# EAGLE design BPM7004 RetroCade Synth MegaWing-alt3 (EAGLE 5.11)
DIGIKEY#: 311-390GRCT-ND
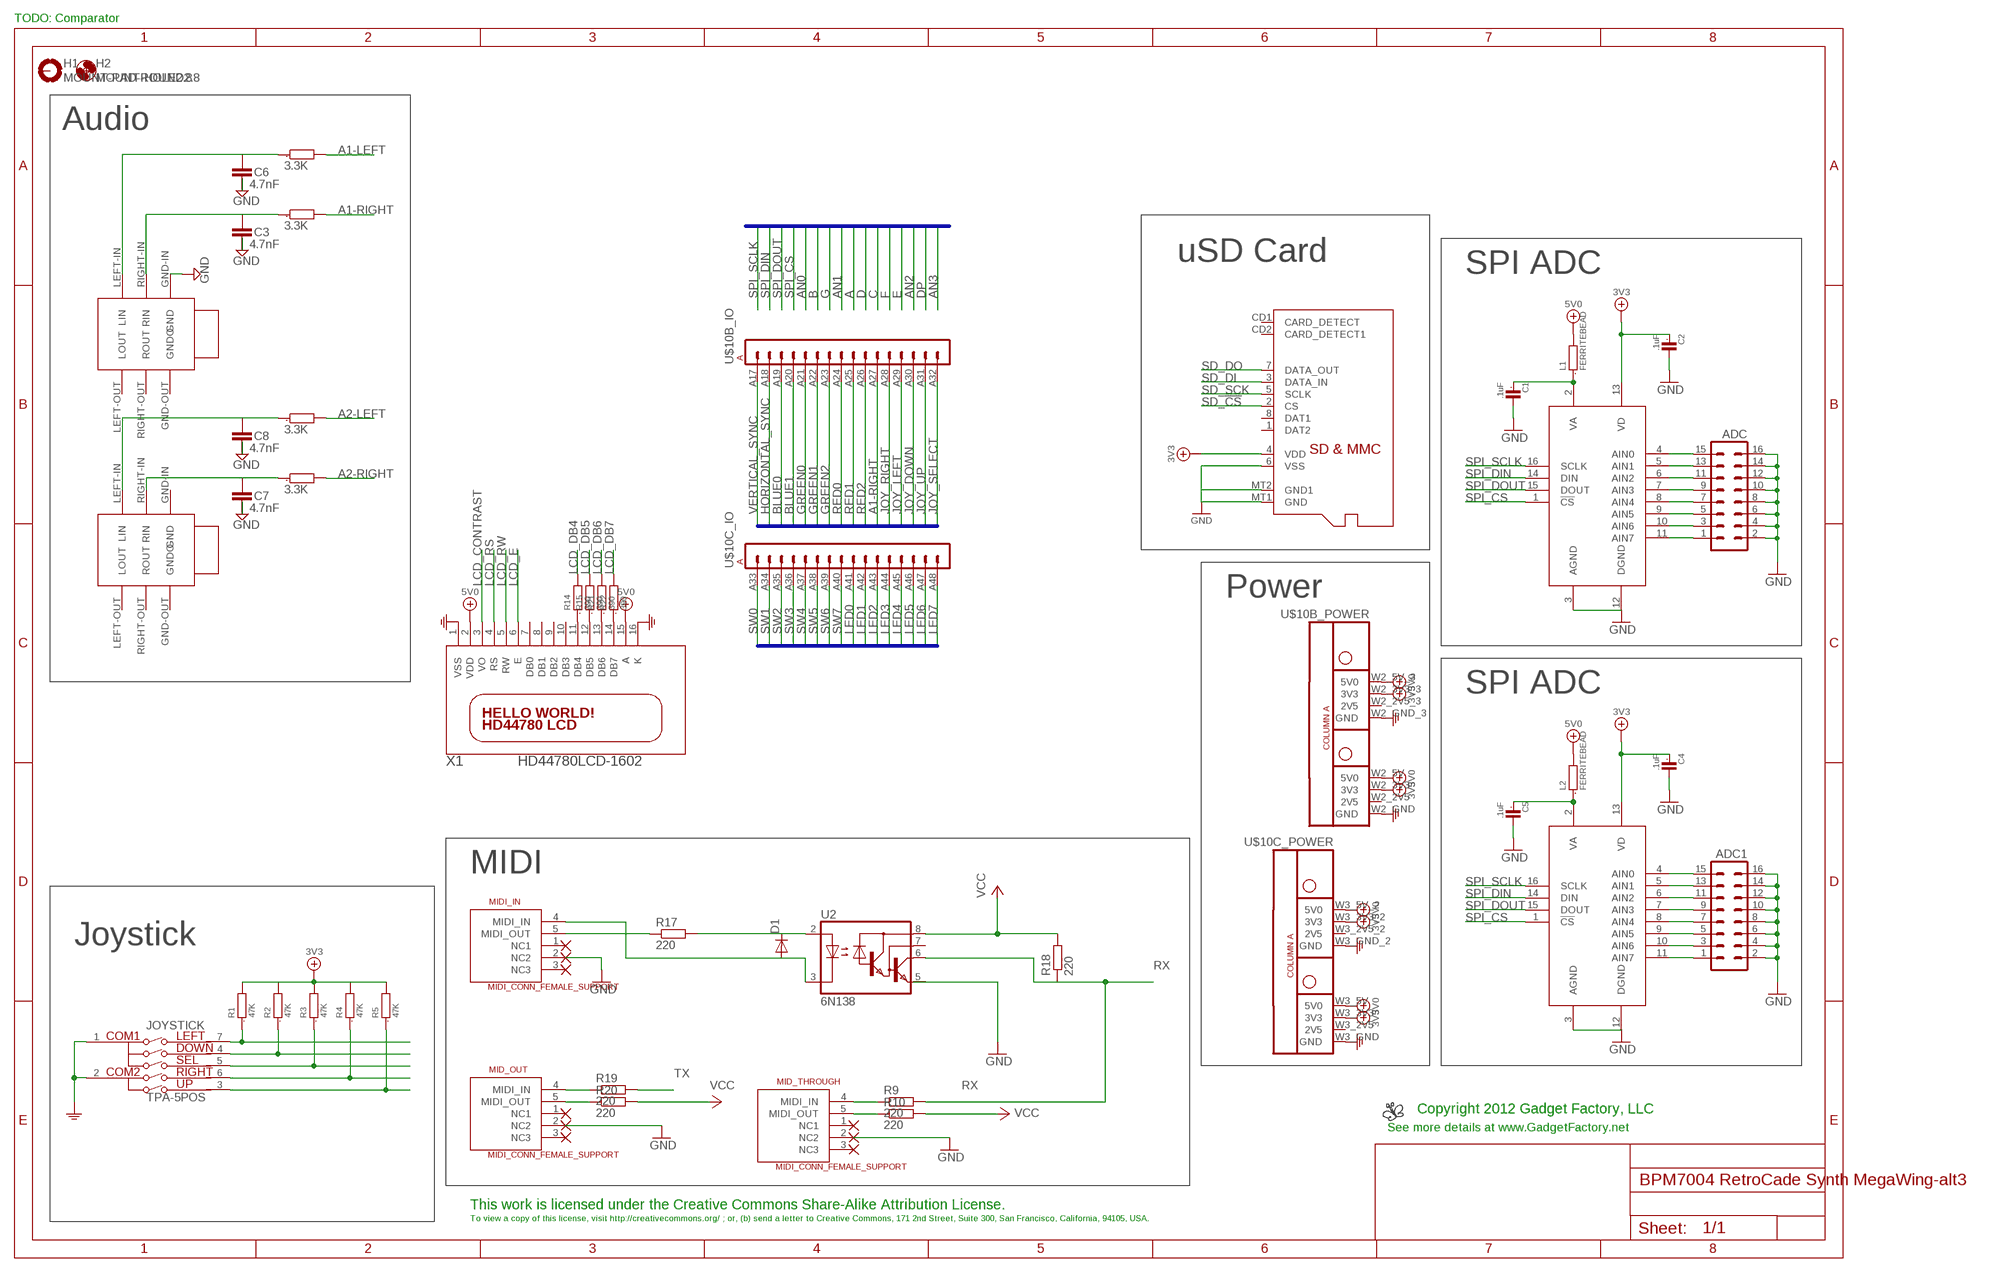
[diagram p0: schematic, sheet 1]

## Parts
A1  NMJ6HFD2  [NMJ6HFD2]
A2  NMJ6HFD2  [NMJ6HFD2]
ADC  MA08-2  [MA08-2]
ADC1  MA08-2  [MA08-2]
C1  .1uF  C0603  [0603]
C2  .1uF  C0603  [0603]
C3  4.7nF  C-EUC0603  [C0603]
C4  .1uF  C0603  [0603]
C5  .1uF  C0603  [0603]
C6  4.7nF  C-EUC0805  [C0805]
C7  4.7nF  C-EUC0603  [C0603]
C8  4.7nF  C-EUC0603  [C0603]
D1  DIODESOD  [SOD-323]
H1  MOUNT-PAD-ROUND2.8  [2,8-PAD]
H2  MOUNT-HOLE2.8  [2,8]
JOYSTICK  TPA-5POS  [TPA-5POS]
L1  FERRITEBEAD  R0603  [0603]
L2  FERRITEBEAD  R0603  [0603]
LOGO1  BUTTERFLY_LOGO  [BUTTERFLY_LOGO]
MID_OUT  MIDI_CONN_FEMALE_SUPPORT  [DIN_5_FEMALE_SUPPORT]
MID_THROUGH  MIDI_CONN_FEMALE_SUPPORT  [DIN_5_FEMALE_SUPPORT]
MIDI_IN  MIDI_CONN_FEMALE_SUPPORT  [DIN_5_FEMALE_SUPPORT]
R1  47K  R0603  [0603]
R2  47K  R0603  [0603]
R3  47K  R0603  [0603]
R4  47K  R0603  [0603]
R5  47K  R0603  [0603]
R6  3.3K  R0603  [0603]
R7  3.3K  R0603  [0603]
R8  3.3K  R0603  [0603]
R9  220  R-EU_R0805  [R0805]
R10  220  R-EU_R0805  [R0805]
R14  390  R0603  [0603]
R15  390  R0603  [0603]
R16  3.3K  R0603  [0603]
R17  220  R-EU_R0805  [R0805]
R18  220  R-EU_R0805  [R0805]
R19  220  R-EU_R0805  [R0805]
R20  220  R-EU_R0805  [R0805]
R21  390  R0603  [0603]
R22  390  R0603  [0603]
U1  ADC088S102CIMT  [TSSOP16]
U2  6N138  [DIL08]
U3  ADC088S102CIMT  [TSSOP16]
U$3  MICROSD  [MICROSD]
U$10  MEGAWING_HALF_P1  [MEGAWING_HALF_NOHOLES_P1]
X1  HD44780LCD-1602  [LCD1602]

## Nets
3V3: C2.1 C4.1 R1.2 R2.2 R3.2 R4.2 R5.2 U1.13(VD) U3.13(VD) U$3.4(VDD) U$10.W2_3V3(B_POWER:3V3) U$10.W2_3V3_3(B_POWER:3V3) U$10.W3_3V3(C_POWER:3V3) U$10.W3_3V3_2(C_POWER:3V3)
5V0: L1.2 L2.2 U$10.W2_5V(B_POWER:5V0) U$10.W2_5V_3(B_POWER:5V0) U$10.W3_5V(C_POWER:5V0) U$10.W3_5V_2(C_POWER:5V0) X1.2(VDD) X1.15(A)
A1-LEFT: R6.2
A1-RIGHT: R16.2 U$10.A27(B_IO:A11)
A2-LEFT: R8.2
A2-RIGHT: R7.2
BLUE0: U$10.A19(B_IO:A3)
BLUE1: U$10.A20(B_IO:A4)
GND: A1.GND-IN(GND) ADC1.2 ADC1.4 ADC1.6 ADC1.8 ADC1.10 ADC1.12 ADC1.14 ADC1.16 ADC.2 ADC.4 ADC.6 ADC.8 ADC.10 ADC.12 ADC.14 ADC.16 C1.2 C2.2 C3.2 C4.2 C5.2 C6.2 C7.2 C8.2 JOYSTICK.1(COM1) JOYSTICK.2(COM2) MID_OUT.2(NC2) MID_THROUGH.2(NC2) MIDI_IN.2(NC2) U1.3(AGND) U1.12(DGND) U2.5(GND) U3.3(AGND) U3.12(DGND) U$3.6(VSS) U$3.MT1(GND) U$3.MT2(GND1) U$10.W2_GND(B_POWER:GND) U$10.W2_GND_3(B_POWER:GND) U$10.W3_GND(C_POWER:GND) U$10.W3_GND_2(C_POWER:GND) X1.1(VSS) X1.16(K) ; supply symbol labelled AGND
GREEN0: U$10.A21(B_IO:A5)
GREEN1: U$10.A22(B_IO:A6)
GREEN2: U$10.A23(B_IO:A7)
HORIZONTAL_SYNC: U$10.A18(B_IO:A2)
JOY_DOWN: JOYSTICK.4(DOWN) R2.1 U$10.A30(B_IO:A14)
JOY_LEFT: JOYSTICK.7(LEFT) R1.1 U$10.A29(B_IO:A13)
JOY_RIGHT: JOYSTICK.6(RIGHT) R4.1 U$10.A28(B_IO:A12)
JOY_SELECT: JOYSTICK.5(SELECT) R3.1 U$10.A32(B_IO:A16)
JOY_UP: JOYSTICK.3(UP) R5.1 U$10.A31(B_IO:A15)
LCD_CONTRAST: X1.3(VO)
LCD_DB4: R14.2
LCD_DB5: R15.2
LCD_DB6: R21.2
LCD_DB7: R22.2
LCD_E: X1.6(E)
LCD_RS: X1.4(RS)
LCD_RW: X1.5(RW)
LED0: U$10.A41(C_IO:A9)
LED1: U$10.A42(C_IO:A10)
LED2: U$10.A43(C_IO:A11)
LED3: U$10.A44(C_IO:A12)
LED4: U$10.A45(C_IO:A13)
LED5: U$10.A46(C_IO:A14)
LED6: U$10.A47(C_IO:A15)
LED7: U$10.A48(C_IO:A16)
N$1: MIDI_IN.5(MIDI_OUT) R17.1
N$2: D1.2(A) MIDI_IN.4(MIDI_IN) U2.3(C)
N$3: D1.1(C) R17.2 U2.2(A)
N$4: A1.RIGHT-IN(RIN) C3.1 R16.1
N$5: MID_OUT.4(MIDI_IN) R19.1
N$6: C5.1 L2.1 U3.2(VA)
N$7: MID_OUT.5(MIDI_OUT) R20.1
N$8: ADC1.1 U3.11(AIN7)
N$9: ADC1.3 U3.10(AIN6)
N$10: ADC1.5 U3.9(AIN5)
N$11: ADC1.7 U3.8(AIN4)
N$12: ADC1.9 U3.7(AIN3)
N$13: ADC1.11 U3.6(AIN2)
N$14: ADC1.13 U3.5(AIN1)
N$15: ADC1.15 U3.4(AIN0)
N$16: A1.LEFT-IN(LIN) C6.1 R6.1
N$17: A2.RIGHT-IN(RIN) C7.1 R7.1
N$18: A2.LEFT-IN(LIN) C8.1 R8.1
N$19: MID_THROUGH.4(MIDI_IN) R9.1
N$20: MID_THROUGH.5(MIDI_OUT) R10.1
N$24: R14.1 X1.11(DB4)
N$25: R15.1 X1.12(DB5)
N$26: R21.1 X1.13(DB6)
N$27: R22.1 X1.14(DB7)
N$37: C1.1 L1.1 U1.2(VA)
N$39: ADC.1 U1.11(AIN7)
N$40: ADC.3 U1.10(AIN6)
N$41: ADC.5 U1.9(AIN5)
N$42: ADC.7 U1.8(AIN4)
N$43: ADC.9 U1.7(AIN3)
N$44: ADC.11 U1.6(AIN2)
N$45: ADC.13 U1.5(AIN1)
N$46: ADC.15 U1.4(AIN0)
RED0: U$10.A24(B_IO:A8)
RED1: U$10.A25(B_IO:A9)
RED2: U$10.A26(B_IO:A10)
RX: R9.2 R18.1 U2.6(VO)
SD_!CS: U$3.2(CS)
SD_DI: U$3.3(DATA_IN)
SD_DO: U$3.7(DATA_OUT)
SD_SCK: U$3.5(SCLK)
SPI_CS: U1.1(!CS) U3.1(!CS)
SPI_DIN: U1.14(DIN) U3.14(DIN)
SPI_DOUT: U1.15(DOUT) U3.15(DOUT)
SPI_SCLK: U1.16(SCLK) U3.16(SCLK)
SW0: U$10.A33(C_IO:A1)
SW1: U$10.A34(C_IO:A2)
SW2: U$10.A35(C_IO:A3)
SW3: U$10.A36(C_IO:A4)
SW4: U$10.A37(C_IO:A5)
SW5: U$10.A38(C_IO:A6)
SW6: U$10.A39(C_IO:A7)
SW7: U$10.A40(C_IO:A8)
TX: R19.2
VCC: R10.2 R18.2 R20.2 U2.8(VCC)
VERTICAL_SYNC: U$10.A17(B_IO:A1)
Unconnected: A1.GND-OUT(GNDO) A1.LEFT-OUT(LOUT) A1.RIGHT-OUT(ROUT) A2.GND-IN(GND) A2.GND-OUT(GNDO) A2.LEFT-OUT(LOUT) A2.RIGHT-OUT(ROUT) H1.B2,8(MOUNT) MID_OUT.1(NC1) MID_OUT.3(NC3) MID_THROUGH.1(NC1) MID_THROUGH.3(NC3) MIDI_IN.1(NC1) MIDI_IN.3(NC3) U2.7(VB) U$3.1(DAT2) U$3.8(DAT1) U$3.CD1(CARD_DETECT) U$3.CD2(CARD_DETECT1) U$10.W2_2V5(B_POWER:2V5) U$10.W2_2V5_3(B_POWER:2V5) U$10.W3_2V5(C_POWER:2V5) U$10.W3_2V5_2(C_POWER:2V5) X1.7(DB0) X1.8(DB1) X1.9(DB2) X1.10(DB3)

## Buses
SW[0..7],LED[0..7]
RED[0..2],GREEN[0..2],BLUE[0..1],VERTICAL_SYNC,HORIZONTAL_SYNC,AUDIO,SPI_SCLK,SPI_DIN,SPI_DOUT,SPI_CS,JOY_SELECT,JOY_RIGHT,JOY_LEFT,JOY_DOWN,JOY_UP,AN[0..3],A,B,C,D,E,F,G,DP

## Notes on the sheet
- TODO: Comparator
- Audio
- uSD Card
- SPI ADC
- Power
- SPI ADC
- MIDI
- Joystick
- Copyright 2012 Gadget Factory, LLC
- See more details at www.GadgetFactory.net
- This work is licensed under the Creative Commons Share-Alike Attribution License.
- To view a copy of this license, visit http://creativecommons.org/ ; or, (b) send a letter to Creative Commons, 171 2nd Street, Suite 300, San Francisco, California, 94105, USA.

## Library data of the parts
A1 A2 = Neutrik:NMJ6HFD2
ADC ADC1 = con-lstb:MA08-2: PIN HEADER
C1 C2 C4 C5 = GadgetFactory:C: CAPACITOR, European symbol
C3 C6-C8 = resistor:C-EU: CAPACITOR, European symbol
D1 = SparkFun:DIODE: Diode These are standard reverse protection diodes and small signal diodes. SMA package can handle up to about 1A. SOD-323 can handle about 200mA. What the SOD-323 package when ordering, there are some mfgs out there that are 5-pin packages.
H1 = holes:MOUNT-PAD-ROUND: MOUNTING PAD, round
H2 = holes:MOUNT-HOLE: MOUNTING HOLE with drill center marker
JOYSTICK = proxmark:TPA-5POS: Navigation switch, 4 directions with select Digikey part: 401-1130-1-ND
L1 L2 R1-R8 R14-R16 R21 R22 = GadgetFactory:R: RESISTOR, European symbol
LOGO1 = GadgetFactory_Pub:BUTTERFLY_LOGO
MID_OUT MID_THROUGH MIDI_IN = SparkFun:MIDI_CONN_FEMALE_SUPPORT
R9 R10 R17-R20 = rcl:R-EU_: RESISTOR, European symbol
U1 U3 = spiadc:ADC088S102
U2 = optocoupler:6N138: MOTOROLA OPTO COUPLER; MF: VISHAY/TELEFUNKEN; MPN: 6N138; OC_FARNELL: 9860150; OC_NEWARK: 35K5294
U$3 = adafruit:MICROSD: Micro-SD / Transflash card holder with SPI pinout For the 3M # 2908-05WB-MG and/or 4UCON #19656 push-push type
U$10 = Papilio:MEGAWING_HALF_P1
X1 = adafruit:HD44780LCD: HD44780 LCD Standard character type LCDs, available in sizes from 8x1 to 40x4!

## Board
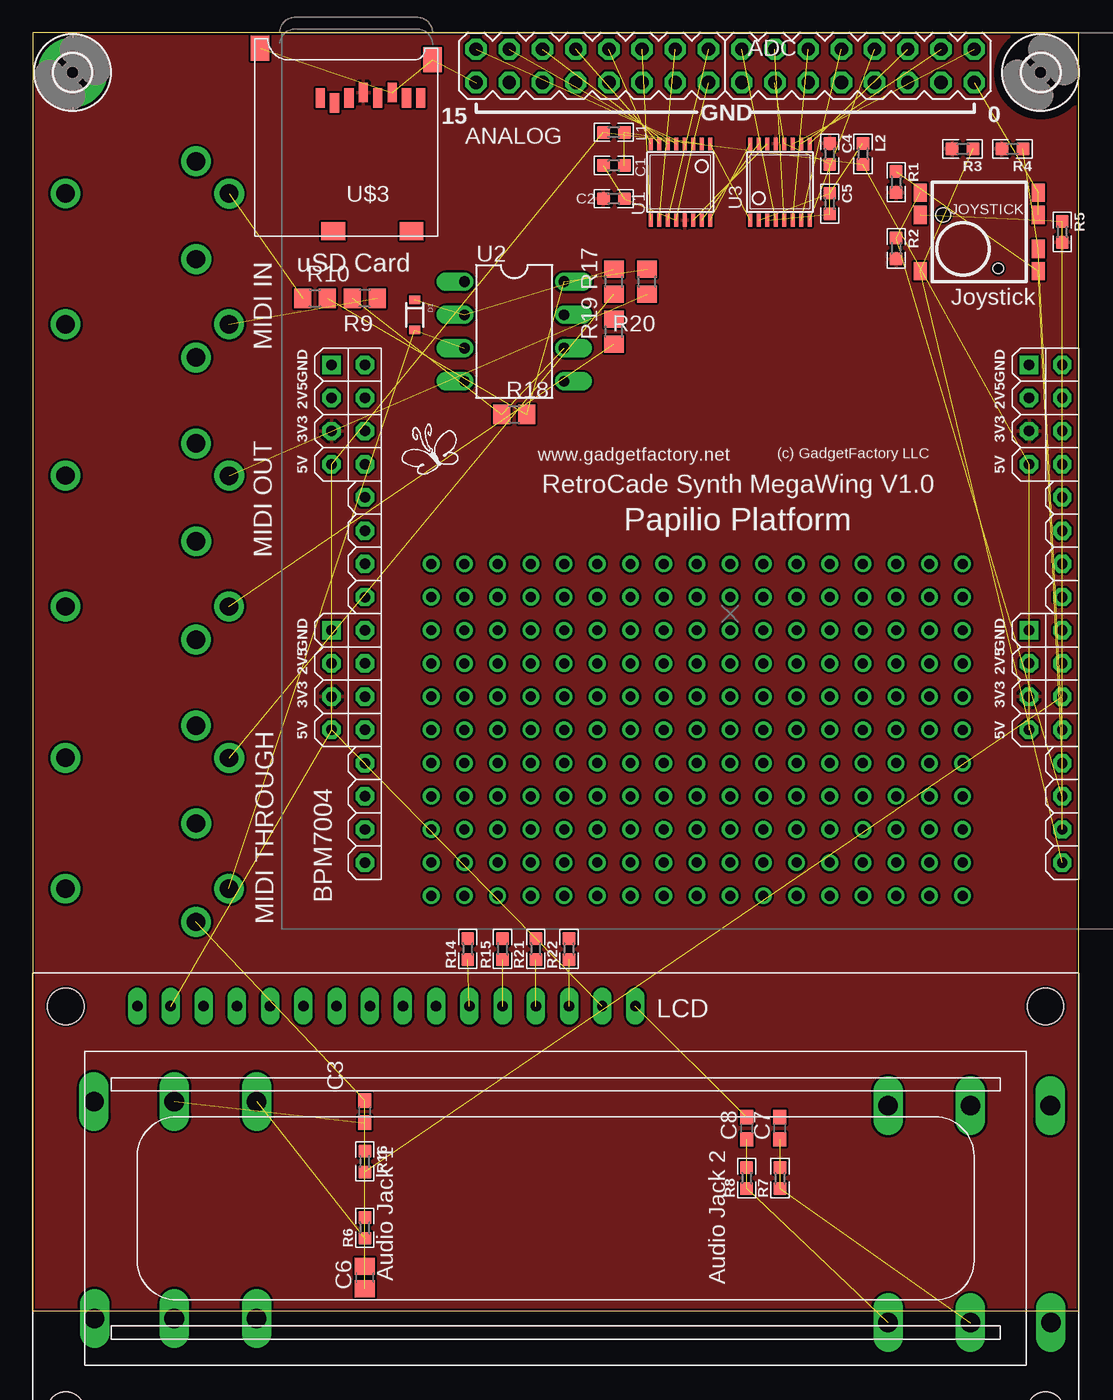
[diagram p1: board, top side]
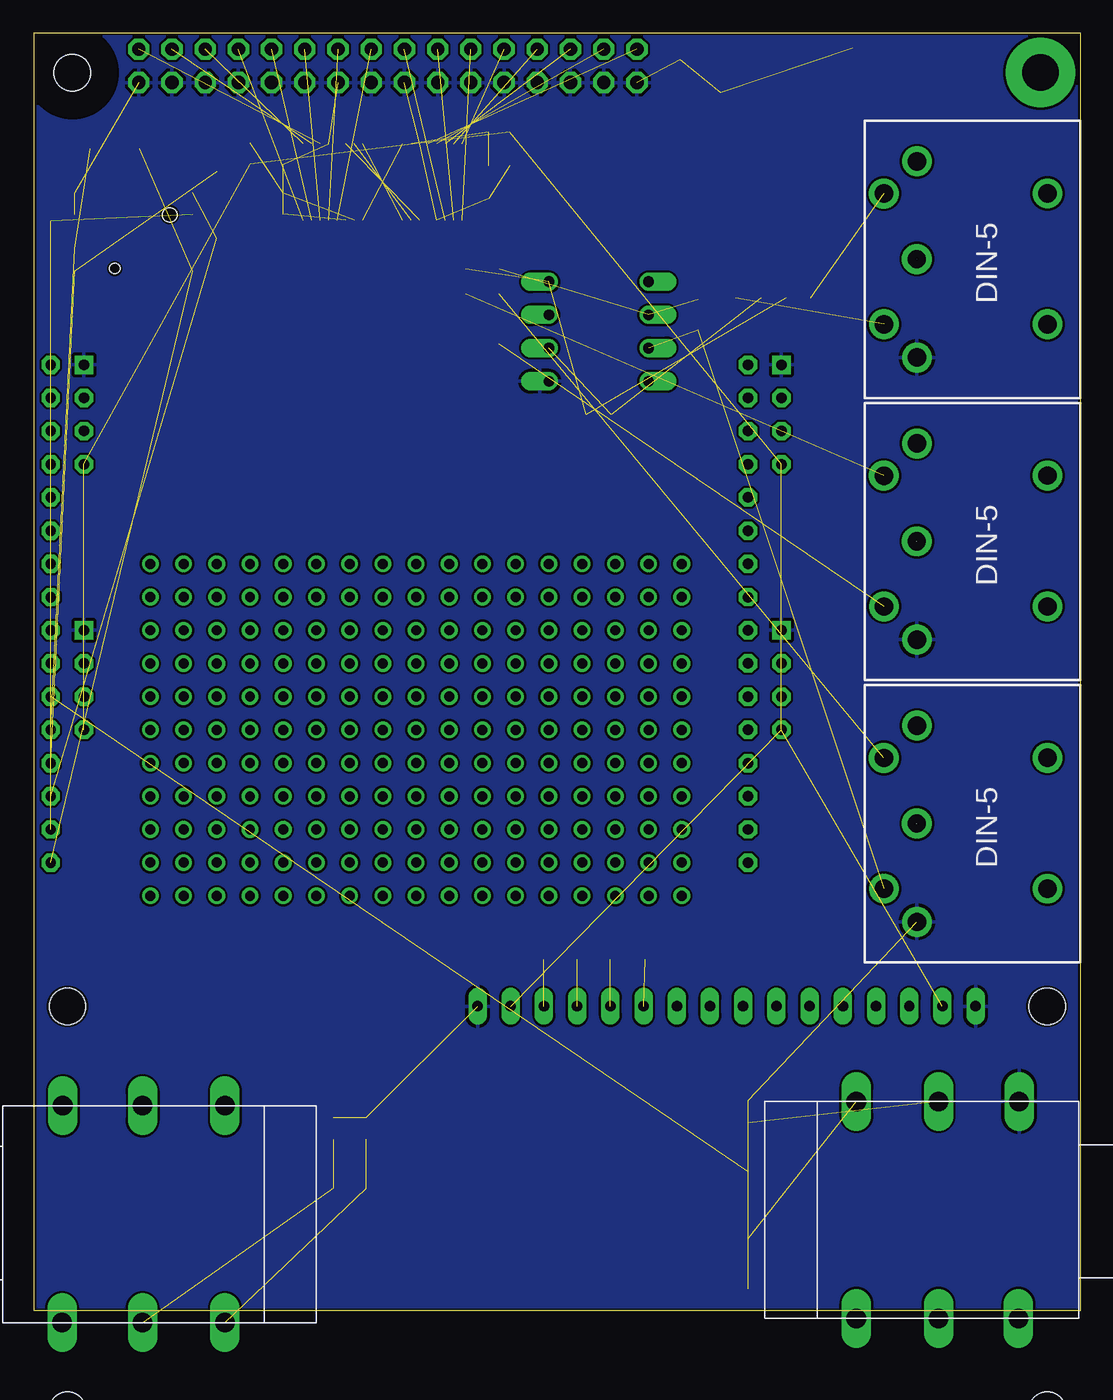
[diagram p2: board, bottom side, seen from below]

Size 80 x 97.79 mm. Coordinates in mm from the lower left corner, seen from the top.
Outline: 0,97.79 0,0 80,0 80,97.79 0,97.79
Copper layers (1*16): Top 0.035mm / dielectric 1.5mm / Bottom 0.035mm
Design rules "SparkFun_Derived_GoldePheonix_7mil *": minimum track width 7mil, minimum drill 15mil, track to track 7mil, track to pad 7mil, pad to pad 7mil, via to via 7mil, smd to smd 7mil, copper to edge 7mil, drill to drill 7mil, minimum pad ring 12mil, minimum via ring 10mil, stop-mask expansion 4mil, vias tented up to drill 18mil, thermal gap 10mil

### Footprints (pad centres in the part's own frame; a part is rotated, then mirrored left to right if it is on the bottom)
NMJ6HFD2 = drill 1.5 long: GND-IN -8.4,19.45; GND-OUT 8.2,19.4; LEFT-IN -8.4,7; LEFT-OUT 8.2,7; RIGHT-IN -8.4,13.3; RIGHT-OUT 8.2,13.3
MA08-2 = drill 1.016 octagon: 1 -8.89,-1.27; 2 -8.89,1.27; 3 -6.35,-1.27; 4 -6.35,1.27; 5 -3.81,-1.27; 6 -3.81,1.27; 7 -1.27,-1.27; 8 -1.27,1.27; 9 1.27,-1.27; 10 1.27,1.27; 11 3.81,-1.27; 12 3.81,1.27; 13 6.35,-1.27; 14 6.35,1.27; 15 8.89,-1.27; 16 8.89,1.27
0603 = smd 1 x 1: 1 -0.8,0; 2 0.8,0
C0603 = smd 1.1 x 1: 1 -0.85,0; 2 0.85,0
C0805 = smd 1.3 x 1.5: 1 -0.85,0; 2 0.85,0
SOD-323 = smd 0.63 x 0.83: 1 -1.15,0; 2 1.15,0
2,8-PAD = drill 2.8 pad 5.334 round: B2,8 0,0
2,8 = hole 2.8: 0,0
TPA-5POS = smd 1 x 1.4: 1 -4.5,-3; 2 -4.5,-1.3; 3 4.5,-1.3; 4 4.5,-3; 5 4.5,3; 6 -4.5,1.3; 7 -4.5,3 | hole 0.8: -1.45,2.8 | hole 1.1: 2.75,-1.3
DIN_5_FEMALE_SUPPORT = drill 1.4 pad 2.286 round: 1 0.46,3.61; 2 -7.07,3.6; 3 7.94,3.6; 4 -4.53,6.12; 5 5.47,6.13; 6 -4.53,-6.382; 7 5.478,-6.382
R0805 = smd 1.3 x 1.5: 1 -0.95,0; 2 0.95,0
TSSOP16 = smd 0.305 x 0.991: 1 -2.275,-2.918; 2 -1.625,-2.918; 3 -0.975,-2.918; 4 -0.325,-2.918; 5 0.325,-2.918; 6 0.975,-2.918; 7 1.625,-2.918; 8 2.275,-2.918; 9 2.275,2.918; 10 1.625,2.918; 11 0.975,2.918; 12 0.325,2.918; 13 -0.325,2.918; 14 -0.975,2.918; 15 -1.625,2.918; 16 -2.275,2.918
DIL08 = drill 0.813 offset: 1 -3.81,-3.81; 2 -1.27,-3.81; 3 1.27,-3.81; 4 3.81,-3.81; 5 3.81,3.81; 6 1.27,3.81; 7 -1.27,3.81; 8 -3.81,3.81
MICROSD = smd 0.7 x 1.5: 1 9,-10.64; 2 7.9,-10.24; 3 6.8,-10.64; 4 5.7,-11.04; 5 4.6,-10.64; 6 3.5,-11.04; 7 2.4,-10.64; 8 1.3,-10.64 | smd 1.8 x 1.4: CD1 2,-0.44; CD2 8,-0.44 | smd 1.4 x 1.9: MT1 0.4,-13.54; MT2 13.6,-14.44
MEGAWING_HALF_NOHOLES_P1 = drill 0.8 octagon: A17 59.69,43.18; A18 59.69,40.64; A19 59.69,38.1; A20 59.69,35.56; A21 59.69,33.02; A22 59.69,30.48; A23 59.69,27.94; A24 59.69,25.4; A25 59.69,22.86; A26 59.69,20.32; A27 59.69,17.78; A28 59.69,15.24; A29 59.69,12.7; A30 59.69,10.16; A31 59.69,7.62; A32 59.69,5.08; A33 6.35,43.18; A34 6.35,40.64; A35 6.35,38.1; A36 6.35,35.56; A37 6.35,33.02; A38 6.35,30.48; A39 6.35,27.94; A40 6.35,25.4; A41 6.35,22.86; A42 6.35,20.32; A43 6.35,17.78; A44 6.35,15.24; A45 6.35,12.7; A46 6.35,10.16; A47 6.35,7.62; A48 6.35,5.08; W2_2V5 57.15,40.64; W2_2V5_3 57.15,20.32; W2_3V3 57.15,38.1; W2_3V3_3 57.15,17.78; W2_5V 57.15,35.56; W2_5V_3 57.15,15.24; W3_2V5 3.81,40.64; W3_2V5_2 3.81,20.32; W3_3V3 3.81,38.1; W3_3V3_2 3.81,17.78; W3_5V 3.81,35.56; W3_5V_2 3.81,15.24 | drill 0.8 square: W2_GND 57.15,43.18; W2_GND_3 57.15,22.86; W3_GND 3.81,43.18; W3_GND_2 3.81,22.86
LCD1602 = drill 0.8 long: 1 8,33.46; 2 10.54,33.46; 3 13.08,33.46; 4 15.62,33.46; 5 18.16,33.46; 6 20.7,33.46; 7 23.24,33.46; 8 25.78,33.46; 9 28.32,33.46; 10 30.86,33.46; 11 33.4,33.46; 12 35.94,33.46; 13 38.48,33.46; 14 41.02,33.46; 15 43.56,33.46; 16 46.1,33.46 | hole 2.8: 2.54,2.54; 2.54,33.46; 77.46,33.46; 77.46,2.54

### Placement (x,y rotation side)
A1  24.13,7.62 270 bottom
A2  58.42,7.49 90 bottom
ADC  42.8,95.25 180 top
ADC1  63.12,95.25 180 top
C1  44.45,87.63 180 top
C2  44.45,85.09 0 top
C3  25.4,15.24 90 top
C4  60.96,88.52 270 top
C5  60.96,84.71 270 top
C6  25.4,2.54 90 top
C7  57.15,13.97 90 top
C8  54.61,13.97 90 top
D1  29.21,76.2 270 top
H1  3.05,94.74 0 top
H2  77.09,94.74 0 top
JOYSTICK  72.39,82.55 180 top
L1  44.45,90.17 180 top
L2  63.5,88.52 270 top
LOGO1  30.48,65.41 0 top
MID_OUT  8.89,58.42 90 bottom
MID_THROUGH  8.89,80.01 90 bottom
MIDI_IN  8.89,36.83 90 bottom
R1  66.04,86.36 270 top
R2  66.04,81.28 270 top
R3  71.12,88.9 180 top
R4  74.93,88.9 180 top
R5  78.74,82.55 270 top
R6  25.4,6.35 90 top
R7  57.15,10.16 90 top
R8  54.61,10.16 90 top
R9  25.4,77.47 180 top
R10  21.59,77.47 0 top
R14  33.27,27.69 90 top
R15  35.94,27.69 90 top
R16  25.4,11.43 270 top
R17  44.45,78.74 90 top
R18  36.83,68.58 0 top
R19  44.45,74.93 90 top
R20  46.99,78.74 90 top
R21  38.48,27.69 90 top
R22  41.02,27.69 90 top
U1  49.53,86.36 180 top
U2  36.83,74.93 270 top
U3  57.15,86.36 0 top
U$3  30.99,82.17 180 top
U$10  19.05,29.21 0 top
X1  0,-10.16 0 top

### Tracks (layer width: path | path; a pad name or v marks a point on that pad's centre or on a via)
3V3
  pour Top: 0,97.79 0,0 80.01,0 80.01,97.79
5V0  (7 unrouted)
A1-RIGHT  (1 unrouted)
GND  (17 unrouted)
  pour Bottom: 0,97.79 0,0 80.01,0 80.01,97.79
JOY_DOWN  (2 unrouted)
JOY_LEFT  (2 unrouted)
JOY_RIGHT  (2 unrouted)
JOY_SELECT  (2 unrouted)
JOY_UP  (2 unrouted)
N$1  (1 unrouted)
N$2  (2 unrouted)
N$3  (2 unrouted)
N$4  (2 unrouted)
N$5  (1 unrouted)
N$6  (2 unrouted)
N$7  (1 unrouted)
N$8  (1 unrouted)
N$9  (1 unrouted)
N$10  (1 unrouted)
N$11  (1 unrouted)
N$12  (1 unrouted)
N$13  (1 unrouted)
N$14  (1 unrouted)
N$15  (1 unrouted)
N$16  (2 unrouted)
N$17  (2 unrouted)
N$18  (2 unrouted)
N$19  (1 unrouted)
N$20  (1 unrouted)
N$21  (via drill 0.76)
  other vias: 30.48,57.15
N$22  (via drill 0.76)
  other vias: 33.02,57.15
N$23  (via drill 0.76)
  other vias: 33.02,54.61
N$24  (1 unrouted)
N$25  (1 unrouted)
N$26  (1 unrouted)
N$27  (1 unrouted)
N$28  (via drill 0.76)
  other vias: 30.48,54.61
N$29  (via drill 0.76)
  other vias: 30.48,52.07
N$30  (via drill 0.76)
  other vias: 33.02,52.07
N$31  (via drill 0.76)
  other vias: 33.02,49.53
N$32  (via drill 0.76)
  other vias: 30.48,49.53
N$33  (via drill 0.76)
  other vias: 30.48,46.99
N$34  (via drill 0.76)
  other vias: 33.02,46.99
N$35  (via drill 0.76)
  other vias: 33.02,44.45
N$36  (via drill 0.76)
  other vias: 30.48,44.45
N$37  (2 unrouted)
N$38  (via drill 0.76)
  other vias: 30.48,41.91
N$39  (1 unrouted)
N$40  (1 unrouted)
N$41  (1 unrouted)
N$42  (1 unrouted)
N$43  (1 unrouted)
N$44  (1 unrouted)
N$45  (1 unrouted)
N$46  (1 unrouted)
N$47  (via drill 0.76)
  other vias: 33.02,41.91
N$48  (via drill 0.76)
  other vias: 33.02,39.37
N$49  (via drill 0.76)
  other vias: 30.48,39.37
N$50  (via drill 0.76)
  other vias: 30.48,36.83
N$51  (via drill 0.76)
  other vias: 33.02,36.83
N$52  (via drill 0.76)
  other vias: 33.02,34.29
N$53  (via drill 0.76)
  other vias: 30.48,34.29
N$54  (via drill 0.76)
  other vias: 30.48,31.75
N$55  (via drill 0.76)
  other vias: 33.02,31.75
N$56  (via drill 0.76)
  other vias: 35.56,57.15
N$57  (via drill 0.76)
  other vias: 38.1,57.15
N$58  (via drill 0.76)
  other vias: 38.1,54.61
N$59  (via drill 0.76)
  other vias: 35.56,54.61
N$60  (via drill 0.76)
  other vias: 35.56,52.07
N$61  (via drill 0.76)
  other vias: 38.1,52.07
N$62  (via drill 0.76)
  other vias: 38.1,49.53
N$63  (via drill 0.76)
  other vias: 35.56,49.53
N$64  (via drill 0.76)
  other vias: 35.56,46.99
N$65  (via drill 0.76)
  other vias: 38.1,46.99
N$66  (via drill 0.76)
  other vias: 38.1,44.45
N$67  (via drill 0.76)
  other vias: 35.56,44.45
N$68  (via drill 0.76)
  other vias: 35.56,41.91
N$69  (via drill 0.76)
  other vias: 38.1,41.91
N$70  (via drill 0.76)
  other vias: 38.1,39.37
N$71  (via drill 0.76)
  other vias: 35.56,39.37
N$72  (via drill 0.76)
  other vias: 35.56,36.83
N$73  (via drill 0.76)
  other vias: 38.1,36.83
N$74  (via drill 0.76)
  other vias: 38.1,34.29
N$75  (via drill 0.76)
  other vias: 35.56,34.29
N$76  (via drill 0.76)
  other vias: 35.56,31.75
N$77  (via drill 0.76)
  other vias: 38.1,31.75
N$78  (via drill 0.76)
  other vias: 40.64,57.15
N$79  (via drill 0.76)
  other vias: 43.18,57.15
N$80  (via drill 0.76)
  other vias: 43.18,54.61
N$81  (via drill 0.76)
  other vias: 40.64,54.61
N$82  (via drill 0.76)
  other vias: 40.64,52.07
N$83  (via drill 0.76)
  other vias: 43.18,52.07
N$84  (via drill 0.76)
  other vias: 43.18,49.53
N$85  (via drill 0.76)
  other vias: 40.64,49.53
N$86  (via drill 0.76)
  other vias: 40.64,46.99
N$87  (via drill 0.76)
  other vias: 43.18,46.99
N$88  (via drill 0.76)
  other vias: 43.18,44.45
N$89  (via drill 0.76)
  other vias: 40.64,44.45
N$90  (via drill 0.76)
  other vias: 40.64,41.91
N$91  (via drill 0.76)
  other vias: 43.18,41.91
N$92  (via drill 0.76)
  other vias: 43.18,39.37
N$93  (via drill 0.76)
  other vias: 40.64,39.37
N$94  (via drill 0.76)
  other vias: 40.64,36.83
N$95  (via drill 0.76)
  other vias: 43.18,36.83
N$96  (via drill 0.76)
  other vias: 43.18,34.29
N$97  (via drill 0.76)
  other vias: 40.64,34.29
N$98  (via drill 0.76)
  other vias: 40.64,31.75
N$99  (via drill 0.76)
  other vias: 43.18,31.75
N$100  (via drill 0.76)
  other vias: 45.72,57.15
N$101  (via drill 0.76)
  other vias: 48.26,57.15
N$102  (via drill 0.76)
  other vias: 48.26,54.61
N$103  (via drill 0.76)
  other vias: 45.72,54.61
N$104  (via drill 0.76)
  other vias: 45.72,52.07
N$105  (via drill 0.76)
  other vias: 48.26,52.07
N$106  (via drill 0.76)
  other vias: 48.26,49.53
N$107  (via drill 0.76)
  other vias: 45.72,49.53
N$108  (via drill 0.76)
  other vias: 45.72,46.99
N$109  (via drill 0.76)
  other vias: 48.26,46.99
N$110  (via drill 0.76)
  other vias: 48.26,44.45
N$111  (via drill 0.76)
  other vias: 45.72,44.45
N$112  (via drill 0.76)
  other vias: 45.72,41.91
N$113  (via drill 0.76)
  other vias: 48.26,41.91
N$114  (via drill 0.76)
  other vias: 48.26,39.37
N$115  (via drill 0.76)
  other vias: 45.72,39.37
N$116  (via drill 0.76)
  other vias: 45.72,36.83
N$117  (via drill 0.76)
  other vias: 48.26,36.83
N$118  (via drill 0.76)
  other vias: 48.26,34.29
N$119  (via drill 0.76)
  other vias: 45.72,34.29
N$120  (via drill 0.76)
  other vias: 45.72,31.75
N$121  (via drill 0.76)
  other vias: 48.26,31.75
N$122  (via drill 0.76)
  other vias: 50.8,57.15
N$123  (via drill 0.76)
  other vias: 53.34,57.15
N$124  (via drill 0.76)
  other vias: 53.34,54.61
N$125  (via drill 0.76)
  other vias: 50.8,54.61
N$126  (via drill 0.76)
  other vias: 50.8,52.07
N$127  (via drill 0.76)
  other vias: 53.34,52.07
N$128  (via drill 0.76)
  other vias: 53.34,49.53
N$129  (via drill 0.76)
  other vias: 50.8,49.53
N$130  (via drill 0.76)
  other vias: 50.8,46.99
N$131  (via drill 0.76)
  other vias: 53.34,46.99
N$132  (via drill 0.76)
  other vias: 53.34,44.45
N$133  (via drill 0.76)
  other vias: 50.8,44.45
N$134  (via drill 0.76)
  other vias: 50.8,41.91
N$135  (via drill 0.76)
  other vias: 53.34,41.91
N$136  (via drill 0.76)
  other vias: 53.34,39.37
N$137  (via drill 0.76)
  other vias: 50.8,39.37
N$138  (via drill 0.76)
  other vias: 50.8,36.83
N$139  (via drill 0.76)
  other vias: 53.34,36.83
N$140  (via drill 0.76)
  other vias: 53.34,34.29
N$141  (via drill 0.76)
  other vias: 50.8,34.29
N$142  (via drill 0.76)
  other vias: 50.8,31.75
N$143  (via drill 0.76)
  other vias: 53.34,31.75
N$144  (via drill 0.76)
  other vias: 55.88,57.15
N$145  (via drill 0.76)
  other vias: 58.42,57.15
N$146  (via drill 0.76)
  other vias: 58.42,54.61
N$147  (via drill 0.76)
  other vias: 55.88,54.61
N$148  (via drill 0.76)
  other vias: 55.88,52.07
N$149  (via drill 0.76)
  other vias: 58.42,52.07
N$150  (via drill 0.76)
  other vias: 58.42,49.53
N$151  (via drill 0.76)
  other vias: 55.88,49.53
N$152  (via drill 0.76)
  other vias: 55.88,46.99
N$153  (via drill 0.76)
  other vias: 58.42,46.99
N$154  (via drill 0.76)
  other vias: 58.42,44.45
N$155  (via drill 0.76)
  other vias: 55.88,44.45
N$156  (via drill 0.76)
  other vias: 55.88,41.91
N$157  (via drill 0.76)
  other vias: 58.42,41.91
N$158  (via drill 0.76)
  other vias: 58.42,39.37
N$159  (via drill 0.76)
  other vias: 55.88,39.37
N$160  (via drill 0.76)
  other vias: 55.88,36.83
N$161  (via drill 0.76)
  other vias: 58.42,36.83
N$162  (via drill 0.76)
  other vias: 58.42,34.29
N$163  (via drill 0.76)
  other vias: 55.88,34.29
N$164  (via drill 0.76)
  other vias: 55.88,31.75
N$165  (via drill 0.76)
  other vias: 58.42,31.75
N$166  (via drill 0.76)
  other vias: 60.96,57.15
N$167  (via drill 0.76)
  other vias: 63.5,57.15
N$168  (via drill 0.76)
  other vias: 63.5,54.61
N$169  (via drill 0.76)
  other vias: 60.96,54.61
N$170  (via drill 0.76)
  other vias: 60.96,52.07
N$171  (via drill 0.76)
  other vias: 63.5,52.07
N$172  (via drill 0.76)
  other vias: 63.5,49.53
N$173  (via drill 0.76)
  other vias: 60.96,49.53
N$174  (via drill 0.76)
  other vias: 60.96,46.99
N$175  (via drill 0.76)
  other vias: 63.5,46.99
N$176  (via drill 0.76)
  other vias: 63.5,44.45
N$177  (via drill 0.76)
  other vias: 60.96,44.45
N$178  (via drill 0.76)
  other vias: 60.96,41.91
N$179  (via drill 0.76)
  other vias: 63.5,41.91
N$180  (via drill 0.76)
  other vias: 63.5,39.37
N$181  (via drill 0.76)
  other vias: 60.96,39.37
N$182  (via drill 0.76)
  other vias: 60.96,36.83
N$183  (via drill 0.76)
  other vias: 63.5,36.83
N$184  (via drill 0.76)
  other vias: 63.5,34.29
N$185  (via drill 0.76)
  other vias: 60.96,34.29
N$186  (via drill 0.76)
  other vias: 60.96,31.75
N$187  (via drill 0.76)
  other vias: 63.5,31.75
N$188  (via drill 0.76)
  other vias: 66.04,57.15
N$189  (via drill 0.76)
  other vias: 68.58,57.15
N$190  (via drill 0.76)
  other vias: 68.58,54.61
N$191  (via drill 0.76)
  other vias: 66.04,54.61
N$192  (via drill 0.76)
  other vias: 66.04,52.07
N$193  (via drill 0.76)
  other vias: 68.58,52.07
N$194  (via drill 0.76)
  other vias: 68.58,49.53
N$195  (via drill 0.76)
  other vias: 66.04,49.53
N$196  (via drill 0.76)
  other vias: 66.04,46.99
N$197  (via drill 0.76)
  other vias: 68.58,46.99
N$198  (via drill 0.76)
  other vias: 68.58,44.45
N$199  (via drill 0.76)
  other vias: 66.04,44.45
N$200  (via drill 0.76)
  other vias: 66.04,41.91
N$201  (via drill 0.76)
  other vias: 68.58,41.91
N$202  (via drill 0.76)
  other vias: 68.58,39.37
N$203  (via drill 0.76)
  other vias: 66.04,39.37
N$204  (via drill 0.76)
  other vias: 66.04,36.83
N$205  (via drill 0.76)
  other vias: 68.58,36.83
N$206  (via drill 0.76)
  other vias: 68.58,34.29
N$207  (via drill 0.76)
  other vias: 66.04,34.29
N$208  (via drill 0.76)
  other vias: 66.04,31.75
N$209  (via drill 0.76)
  other vias: 68.58,31.75
N$210  (via drill 0.76)
  other vias: 71.12,57.15
N$211  (via drill 0.76)
  other vias: 71.12,54.61
N$212  (via drill 0.76)
  other vias: 71.12,52.07
N$213  (via drill 0.76)
  other vias: 71.12,49.53
N$214  (via drill 0.76)
  other vias: 71.12,46.99
N$215  (via drill 0.76)
  other vias: 71.12,44.45
N$216  (via drill 0.76)
  other vias: 71.12,41.91
N$217  (via drill 0.76)
  other vias: 71.12,39.37
N$218  (via drill 0.76)
  other vias: 71.12,36.83
N$219  (via drill 0.76)
  other vias: 71.12,34.29
N$220  (via drill 0.76)
  other vias: 71.12,31.75
RX  (2 unrouted)
SPI_CS  (1 unrouted)
SPI_DIN  (1 unrouted)
SPI_DOUT  (1 unrouted)
SPI_SCLK  (1 unrouted)
VCC  (3 unrouted)

### Text on the board
tPlace: 15 | GND | 0 | ANALOG | uSD Card | Joystick | MIDI IN | www.gadgetfactory.net | (c) GadgetFactory LLC | RetroCade Synth MegaWing V1.0 | Papilio Platform | MIDI OUT | BPM7004 | MIDI THROUGH | LCD | Audio Jack 1 | Audio Jack 2